# EAGLE schematic Duckietown Rev 2018A (EAGLE 8.5.2)
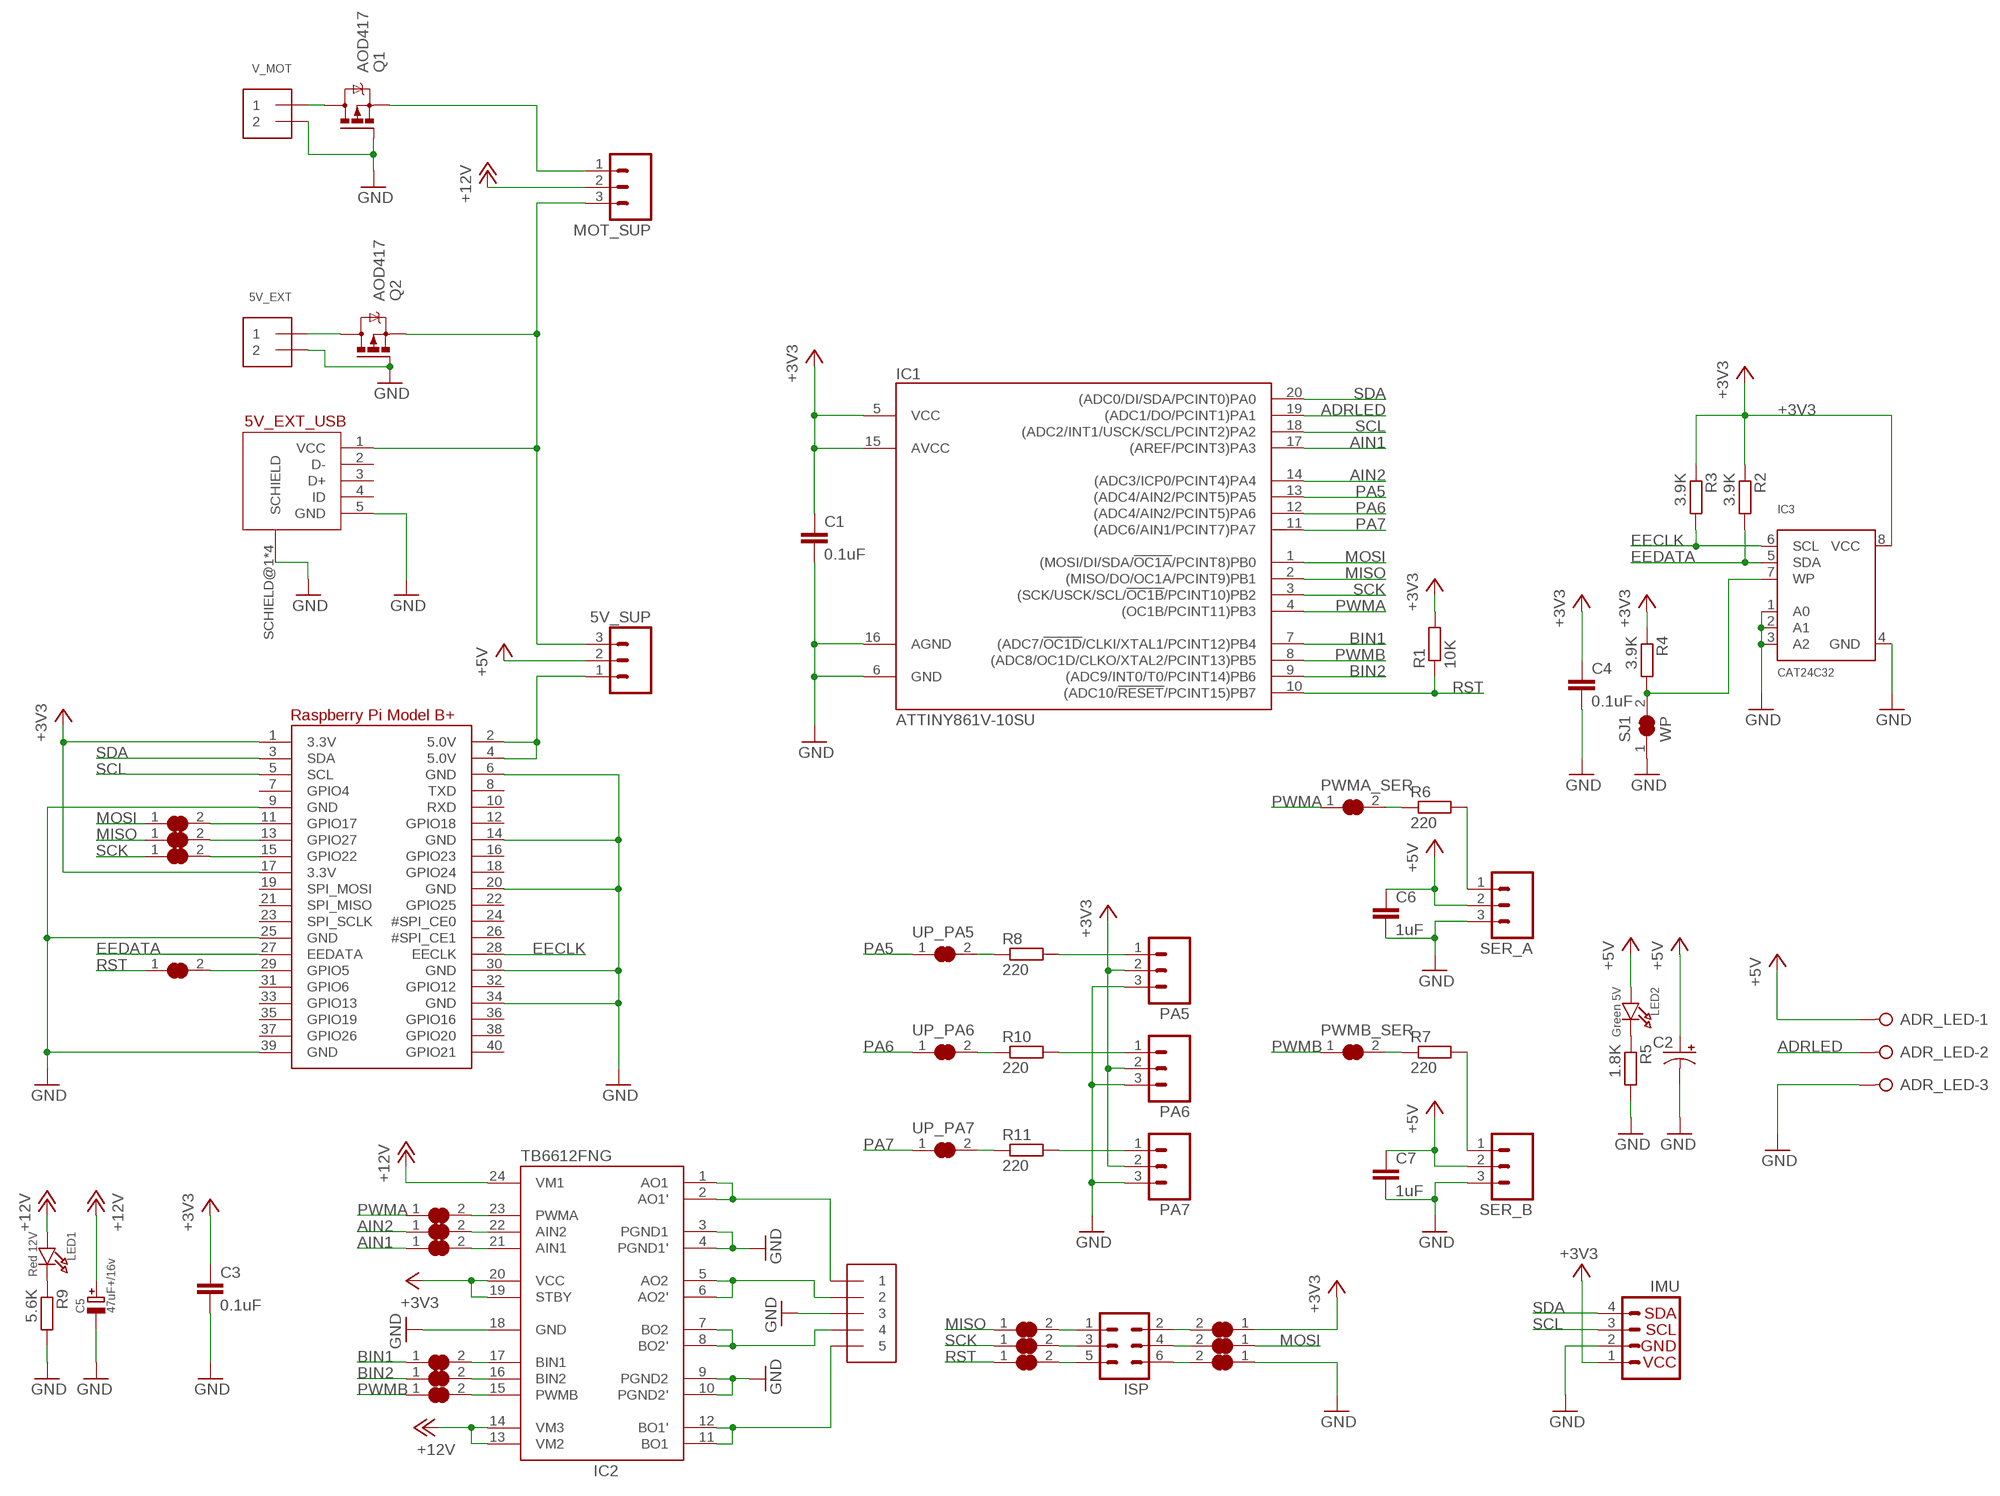
[diagram p0: schematic, sheet 1]

## Parts
5V_EXT  TERMBLOCK_1X2  [TERMBLOCK_1X2-3.5MM]
5V_EXT_USB  MICROUSBCON  [MICROUSBCON]
5V_SUP  M03PTH  [1X03]
ADR_LED  MPT0,5/3-2.54  [MPT0,5/3-2.54]
AIN1  SOLDERJUMPER_CLOSED  [SOLDERJUMPER_CLOSEDWIRE]
AIN2  SOLDERJUMPER_CLOSED  [SOLDERJUMPER_CLOSEDWIRE]
BIN1  SOLDERJUMPER_CLOSED  [SOLDERJUMPER_CLOSEDWIRE]
BIN2  SOLDERJUMPER_CLOSED  [SOLDERJUMPER_CLOSEDWIRE]
C1  0.1uF  C-EUC0603  [C0603]
C2  CPOL-USE3.5-8  [E3,5-8]
C3  0.1uF  C-EUC0603  [C0603]
C4  0.1uF  C-EUC0603  [C0603]
C5  47uF+/16v  CAP_ELECTROLYTICPANASONIC_C  [PANASONIC_C]
C6  1uF  C-EUC0603  [C0603]
C7  1uF  C-EUC0603  [C0603]
GND  SOLDERJUMPER_CLOSED  [SOLDERJUMPER_CLOSEDWIRE]
IC1  ATTINY861V-10SU  [SO20L]
IC2  TB6612FNG  [SSOP24]
IC3  CAT24C32  EEPROM_I2C_SOIC8_GENERIC  [SOIC8_150MIL]
IMU  I2C_IMU_L3GD20H+LSM303  [1X04]
ISP  ML6  [ML6]
LED1  Red 12V  LED0805_NOOUTLINE  [CHIPLED_0805_NOOUTLINE]
LED2  Green 5V  LED0805_NOOUTLINE  [CHIPLED_0805_NOOUTLINE]
MISO  SOLDERJUMPER_CLOSED  [SOLDERJUMPER_CLOSEDWIRE]
MOSI  SOLDERJUMPER_CLOSED  [SOLDERJUMPER_CLOSEDWIRE]
MOT_SUP  M03PTH  [1X03]
MOTA  1X5  [1X05-3.5MM]
PA5  M03PTH  [1X03]
PA6  M03PTH  [1X03]
PA7  M03PTH  [1X03]
PWMA  SOLDERJUMPER_CLOSED  [SOLDERJUMPER_CLOSEDWIRE]
PWMA_SER  SOLDERJUMPER_CLOSED  [SOLDERJUMPER_CLOSEDWIRE]
PWMB  SOLDERJUMPER_CLOSED  [SOLDERJUMPER_CLOSEDWIRE]
PWMB_SER  SOLDERJUMPER_CLOSED  [SOLDERJUMPER_CLOSEDWIRE]
Q1  AOD417  IRFR5305  [D-PAK_TO252AA]
Q2  AOD417  IRFR5305  [D-PAK_TO252AA]
R1  10K  R-EU_R0603  [R0603]
R2  3.9K  R-EU_R0603  [R0603]
R3  3.9K  R-EU_R0603  [R0603]
R4  3.9K  R-EU_R0603  [R0603]
R5  1.8K  R-EU_R0603  [R0603]
R6  220  R-EU_R0603  [R0603]
R7  220  R-EU_R0603  [R0603]
R8  220  R-EU_R0603  [R0603]
R9  5.6K  R-EU_R0603  [R0603]
R10  220  R-EU_R0603  [R0603]
R11  220  R-EU_R0603  [R0603]
RP_MISO  SOLDERJUMPER_CLOSED  [SOLDERJUMPER_CLOSEDWIRE]
RP_MOSI  SOLDERJUMPER_CLOSED  [SOLDERJUMPER_CLOSEDWIRE]
RP_RST  SOLDERJUMPER_CLOSED  [SOLDERJUMPER_CLOSEDWIRE]
RP_SCK  SOLDERJUMPER_CLOSED  [SOLDERJUMPER_CLOSEDWIRE]
RPI2  RASPBERRYPI_BPLUS_HATSLOTS  [PI_HAT_SLOTS]
RST  SOLDERJUMPER_CLOSED  [SOLDERJUMPER_CLOSEDWIRE]
SCK  SOLDERJUMPER_CLOSED  [SOLDERJUMPER_CLOSEDWIRE]
SER_A  M03PTH  [1X03]
SER_B  M03PTH  [1X03]
SJ1  WP  SOLDERJUMPER_CLOSED  [SOLDERJUMPER_CLOSEDWIRE]
UP_PA5  SOLDERJUMPER_CLOSED  [SOLDERJUMPER_CLOSEDWIRE]
UP_PA6  SOLDERJUMPER_CLOSED  [SOLDERJUMPER_CLOSEDWIRE]
UP_PA7  SOLDERJUMPER_CLOSED  [SOLDERJUMPER_CLOSEDWIRE]
V_MOT  TERMBLOCK_1X2  [TERMBLOCK_1X2-3.5MM]
VCC  SOLDERJUMPER_CLOSED  [SOLDERJUMPER_CLOSEDWIRE]

## Nets
5V_RPI [Power]: 5V_SUP.1 RPI2.2(5.0V) RPI2.4(5.0V)
+3V3 [Supply]: C1.1 C3.1 C4.1 IC1.5(VCC) IC1.15(AVCC) IC2.19(STBY) IC2.20(VCC) IC3.8(VCC) IMU.1 PA5.2 PA6.2 PA7.2 R1.2 R2.1 R3.1 R4.1 RPI2.1(3.3V) RPI2.17(3.3V) VCC.1
+5V [Power]: 5V_SUP.2 ADR_LED.1 C2.+ C6.1 C7.1 LED2.A SER_A.2 SER_B.2
+12V [Power]: C5.+ IC2.13(VM2) IC2.14(VM3) IC2.24(VM1) LED1.A MOT_SUP.2
ADRLED: ADR_LED.2 IC1.19((ADC1/DO/PCINT1)PA1)
AIN1: AIN1.1 IC1.17((AREF/PCINT3)PA3)
AIN2: AIN2.1 IC1.14((ADC3/ICP0/PCINT4)PA4)
BIN1: BIN1.1 IC1.7((ADC7/!OC1D!/CLKI/XTAL1/PCINT12)PB4)
BIN2: BIN2.1 IC1.9((ADC9/INT0/T0/PCINT14)PB6)
EECLK: IC3.6(SCL) R3.2 RPI2.28(EECLK)
EEDATA: IC3.5(SDA) R2.2 RPI2.27(EEDATA)
GND: 5V_EXT.2 5V_EXT_USB.5(GND) 5V_EXT_USB.SCHIELD@1(SCHIELD) 5V_EXT_USB.SCHIELD@2(SCHIELD) 5V_EXT_USB.SCHIELD@3(SCHIELD) 5V_EXT_USB.SCHIELD@4(SCHIELD) ADR_LED.3 C1.2 C2.- C3.2 C4.2 C5.- C6.2 C7.2 GND.1 IC1.6(GND) IC1.16(AGND) IC2.3(PGND1) IC2.4(PGND1') IC2.9(PGND2) IC2.10(PGND2') IC2.18(GND) IC3.1(A0) IC3.2(A1) IC3.3(A2) IC3.4(GND) IMU.2 MOTA.3 PA5.3 PA6.3 PA7.3 Q1.1(G) Q2.1(G) R5.2 R9.2 RPI2.6(GND) RPI2.9(GND) RPI2.14(GND) RPI2.20(GND) RPI2.25(GND) RPI2.30(GND) RPI2.34(GND) RPI2.39(GND) SER_A.3 SER_B.3 SJ1.1 V_MOT.2
MISO: IC1.2((MISO/DO/OC1A/PCINT9)PB1) MISO.1 RP_MISO.1
MOSI: IC1.1((MOSI/DI/SDA/!OC1A!/PCINT8)PB0) MOSI.1 RP_MOSI.1
N$1 [Power]: Q1.4(D) V_MOT.1
N$11 [Power]: IC2.5(AO2) IC2.6(AO2') MOTA.2
N$12 [Power]: IC2.7(BO2) IC2.8(BO2') MOTA.4
N$13: LED1.C R9.1
N$14 [Power]: 5V_EXT.1 Q2.4(D)
N$15: LED2.C R5.1
N$16: IC3.7(WP) R4.2 SJ1.2
N$17 [Power]: IC2.11(BO1) IC2.12(BO1') MOTA.5
N$18 [Power]: IC2.1(AO1) IC2.2(AO1') MOTA.1
N$19 [Power]: MOT_SUP.1 Q1.3(S)
N$20: R6.2 SER_A.1
N$22: PA5.1 R8.2
N$23: R7.2 SER_B.1
N$24: PA6.1 R10.2
N$25: PA7.1 R11.2
N$26: IC2.23(PWMA) PWMA.2
N$27: AIN2.2 IC2.22(AIN2)
N$28: AIN1.2 IC2.21(AIN1)
N$29: BIN1.2 IC2.17(BIN1)
N$30: BIN2.2 IC2.16(BIN2)
N$31: IC2.15(PWMB) PWMB.2
N$32: ISP.1 MISO.2
N$33: ISP.3 SCK.2
N$34: ISP.5 RST.2
N$35: ISP.4 MOSI.2
N$36 [Power]: GND.2 ISP.6
N$37 [Supply]: ISP.2 VCC.2
N$38: R10.1 UP_PA6.2
N$39: PWMB_SER.2 R7.1
N$40: PWMA_SER.2 R6.1
N$41: R8.1 UP_PA5.2
N$43: RP_SCK.2 RPI2.15(GPIO22)
N$44: RP_MISO.2 RPI2.13(GPIO27)
N$46: RP_MOSI.2 RPI2.11(GPIO17)
N$48: RP_RST.2 RPI2.29(GPIO5)
N$60: R11.1 UP_PA7.2
PA5: IC1.13((ADC4/AIN2/PCINT5)PA5) UP_PA5.1
PA6: IC1.12((ADC4/AIN2/PCINT5)PA6) UP_PA6.1
PA7: IC1.11((ADC6/AIN1/PCINT7)PA7) UP_PA7.1
PWMA: IC1.4((OC1B/PCINT11)PB3) PWMA.1 PWMA_SER.1
PWMB: IC1.8((ADC8/OC1D/CLKO/XTAL2/PCINT13)PB5) PWMB.1 PWMB_SER.1
RST: IC1.10((ADC10/!RESET!/PCINT15)PB7) R1.1 RP_RST.1 RST.1
SCK: IC1.3((SCK/USCK/SCL/!OC1B!/PCINT10)PB2) RP_SCK.1 SCK.1
SCL: IC1.18((ADC2/INT1/USCK/SCL/PCINT2)PA2) IMU.3 RPI2.5(SCL)
SDA: IC1.20((ADC0/DI/SDA/PCINT0)PA0) IMU.4 RPI2.3(SDA)
VCC: 5V_EXT_USB.1(VCC) 5V_SUP.3 MOT_SUP.3 Q2.3(S)
Unconnected: 5V_EXT_USB.2(D-) 5V_EXT_USB.3(D+) 5V_EXT_USB.4(ID) RPI2.7(GPIO4) RPI2.8(TXD) RPI2.10(RXD) RPI2.12(GPIO18) RPI2.16(GPIO23) RPI2.18(GPIO24) RPI2.19(SPI_MOSI) RPI2.21(SPI_MISO) RPI2.22(GPIO25) RPI2.23(SPI_SCLK) RPI2.24(#SPI_CE0) RPI2.26(#SPI_CE1) RPI2.31(GPIO6) RPI2.32(GPIO12) RPI2.33(GPIO13) RPI2.35(GPIO19) RPI2.36(GPIO16) RPI2.37(GPIO26) RPI2.38(GPIO20) RPI2.40(GPIO21)

## Library data of the parts
5V_EXT V_MOT = microbuilder:TERMBLOCK_1X2: 3.5mm Terminal block http://www.ladyada.net/library/pcb/eaglelibrary.html
5V_EXT_USB = USB Connector:MICROUSBCON: Digi-Key 609-4618-1-ND Amphenol FCI 10118194-0001LF Description CONN USB MICRO B RECPT SMT R/A
5V_SUP MOT_SUP PA5-PA7 SER_A SER_B = cambridge_garage_electronics:M03: Header 3 Standard 3-pin 0.1" header. Use with straight break away headers (SKU : PRT-00116), right angle break away headers (PRT-00553), swiss pins (PRT-00743), machine pins (PRT-00117), and female headers (PRT-00115). Molex polarized connector foot print use with SKU : PRT-08232 with associated crimp pins and housings.
ADR_LED = conPhoenixContact:MPT0,5/3-2.54: WAGO SREW CLAMP
AIN1 AIN2 BIN1 BIN2 GND MISO MOSI PWMA PWMA_SER PWMB PWMB_SER RP_MISO RP_MOSI RP_RST RP_SCK RST SCK SJ1 UP_PA5-UP_PA7 VCC = DuckietownTrafficLight:SOLDERJUMPER_CLOSED: Solder Jumper - Closed These solder jumpers are closed by default CLOSEDWIRE - 10 mil trace between pads that can be cut and resoldered later CLOSEDPERM - 63 mil trace between pads for a permanent connection (used to 'bridge' two signals, a shameless hack for Eagle). Can double as a test point as well (no cream layer)
C1 C3 C4 C6 C7 = rcl:C-EU: CAPACITOR, European symbol; SPICEPREFIX: C
C2 = adafruit:CPOL-US: POLARIZED CAPACITOR, American symbol
C5 = microbuilder:CAP_ELECTROLYTIC: Electrolytic Capacitors SMT PANASONIC_C - Size C Panasonic Electrolytic Aluminum Capacitor 47µF 16V 20% Electrolytic Capacitor [Digikey: PCE3890TR-ND] PANASONIC_D - Size D Panasonic Electrolytic Aluminum Capacitor 100µF 25V 20% Electrolytic Capacitor [Digikey: PCE3898TR-ND] PTH 3.5 mm grid, 8 mm diameter ... 3.5 mm grid, 10 mm diameter ...
IC1 = Attiny86:ATTINY861V-10SU
IC2 = DuckietownTrafficLight:TB6612FNG: TB6612FNG MOS dual H-bridge motor driver, 1.2A current 3.2A peak 3 or 5v logic and 3-15v motor
IC3 = microbuilder:EEPROM_I2C_SOIC8_GENERIC: Note: The same pinout is used for many I2C EEPROMs in SOIC8(150mil) from a variety of manufacturers and in various sizes. Examples: 16K (2K x 8 Bit) I2C EEPROM 1.7-5.5V, 400KHz, -40°C-85°C Digikey: CAT24C16WI-GT3CT-ND 256K (32K x 8 Bit) I2C EEPROM 1.7-5.5V, 400KHz, -40°C-85°C Digikey: 24AA256-I/SN-ND
IMU = cambridge_garage_electronics:I2C_IMU_L3GD20H+LSM303: SparkFun has standardized on a pinout for all I2C based sensor breakouts. This pinout allows I2C boards to be plugged directly into the headers on Arduino Uno compatible boards, and to be daisy chained easily.
ISP = con-harting-ml:ML6: HARTING; OC_FARNELL: unknown; OC_NEWARK: unknown
LED1 LED2 = microbuilder:LED: LED 0603 - 0603 Surface Mount Package 2mA: Green LED - Low Power (3.9mcd, 2ma, 1.7Vf) - Digikey: 475-2709-2-ND Orange LED - Low Power (9.8mcd, 2ma, 1.8Vf) - Digikey: 475-1194-2-ND Red LED - Low Power (5mcd, 2ma, 1.8Vf) - Digikey: 475-1195-2-ND Yellow LED - Low Power (7mcd, 2ma, 1.8Vf) - Digikey: 475-1196-2-ND 5mA: Blue LED - Low Power (17mcd, 5ma, 2.9Vf) - Digikey: LNJ937W8CRACT-ND 0805 - 0805 Surface Mount Package 2mA: Red LED (8.8mcd, 2mA, 1.8Vf, Clear) - Low Power [Digikey: 475-2510-1-ND] Green LED (5mcd, 2mA, 1.8Vf, Clear) - Low Power [Digikey: 475-2730-1-ND] Yellow LED (11.3mcd, 2mA, 1.8Vf, Clear) - Low Power [Digikey: 475-2555-1-ND] 20mA: Red LED (104mcd, 20mA, Diffused) - LS R976 [Digikey: 475-1278-6-ND] Red LED (12mcd, 20mA, 2.0Vf, Clear) - APT2012EC [Digikey: 754-1128-1-ND] Green LED (15mcd, 20mA, 2.2Vf, Clear) - APT2012GC [Digikey: 754-1131-1-ND] Orange LED (160mcd, 20mA, 2.1Vf, Clear) - APT2012SECK [Digikey: 754-1130-1-ND] 1206 - 1206 Surface Mount Package Green LED (26mcd, 20mA, Diffused) - LG N971 [Digikey: 475-1407-6-ND] Red LED (15mcd, 20mA, Diffused) - LH N974 [Digikey: 475-1416-6-ND] Cree - Cree High-Power Surface Mount LEDs XPEBWT-L1-0000-00D50 - White 111lm 350mA 2.9Vf 6200K 110° XTEAWT-00-0000-00000LEE3 - White 114lm 350mA 2.85Vf 5000K 115° Everlight - Everlight 45-21 Series Surface Mount LEDs 45-21/QK2C-B2832AC2CB2/2T - Warm White 2000mcd 20mA 3.25Vf 3050K 120° 45-21/LK2C-B38452C4CB2/2T - Nuetral White 2000mcd 20mA 3.25Vf 4150K 120° 45-21/LK2C-B50634C6CB2/2T - Cold White 2200mcd 20mA 3.25Vf 5650K 120° PLCC2 Reverse Mount LS T77K-J1L2-1-0-2-R18-Z - Red 11.25mcd 2mA 1.8Vf 630nm 120° LO T77K-L1M2-24-Z - Orange 19.6mcd 2mA 1.8Vf 606nm 120° LY T77K-K2M1-26-Z - Yellow 15.7mcd 2mA 1.8Vf 587nm 120°
MOTA = DuckietownTrafficLight:1X5
Q1 Q2 = transistor-power:IRF?5305: HEXFET Power MOSFET Source: http://www.irf.com/product-info/datasheets/data/irfr5305pbf.pdf
R1-R11 = rcl:R-EU_: RESISTOR, European symbol; SPICEPREFIX: R
RPI2 = DuckietownTrafficLight:RASPBERRYPI_BPLUS

## Net classes
0 default: width 0.406 mm, drill 0.406 mm
1 Power: width 0.813 mm, drill 0.813 mm
2 Supply: width 0.61 mm, drill 0.61 mm